# EAGLE design light_detector (EAGLE 7.7.0)
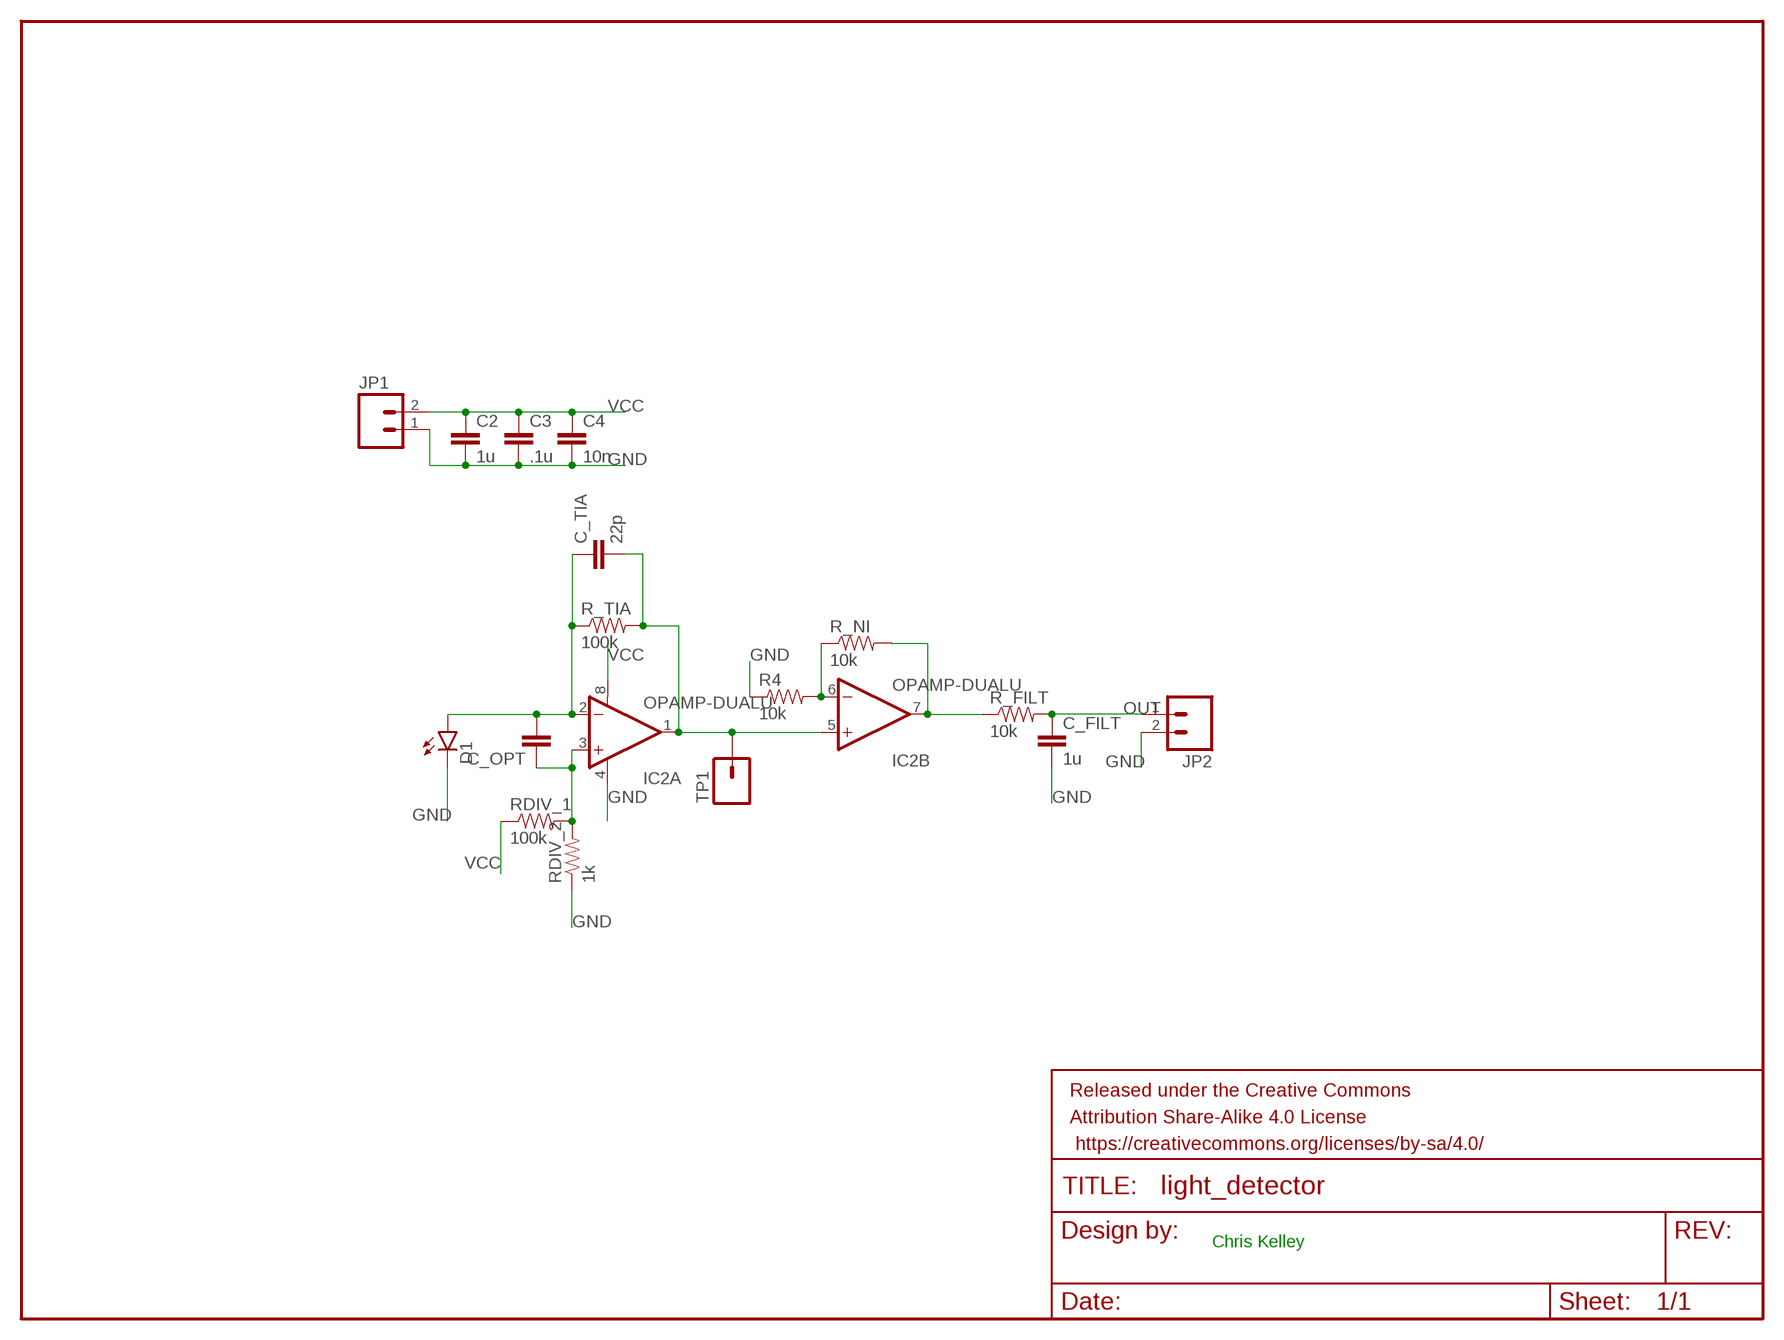
[diagram p0: schematic, sheet 1]

## Parts
C2  1u  CAP0805  [0805]
C3  .1u  CAP0805  [0805]
C4  10n  CAP0805  [0805]
C_FILT  1u  CAP0805  [0805]
C_OPT  CAP0805  [0805]
C_TIA  22p  CAP0805  [0805]
D1  LED5MM  [LED5MM]
FRAME1  FRAME-LETTER  [CREATIVE_COMMONS]
IC2  OPAMP-DUALU  [SO08]
JP1  M02PTH  [1X02]
JP2  M02PTH  [1X02]
R4  10k  RESISTOR0603-RES  [0603-RES]
R_FILT  10k  RESISTOR0603-RES  [0603-RES]
R_NI  10k  RESISTOR0603-RES  [0603-RES]
R_TIA  100k  RESISTOR0603-RES  [0603-RES]
RDIV_1  100k  RESISTOR0603-RES  [0603-RES]
RDIV_2  1k  RESISTOR0603-RES  [0603-RES]
TP1  M01PTH  [1X01]

## Nets
GND: C2.2 C3.2 C4.2 C_FILT.2 D1.K(C) IC2.4(A:V-) JP1.1 JP2.2 R4.1 RDIV_2.1
N$1: C_OPT.2 C_TIA.1 D1.A IC2.2(A:-IN) R_TIA.1
N$2: C_TIA.2 IC2.1(A:OUT) IC2.5(B:+IN) R_TIA.2 TP1.1
N$3: C_OPT.1 IC2.3(A:+IN) RDIV_1.2 RDIV_2.2
N$4: IC2.7(B:OUT) R_FILT.1 R_NI.2
N$5: IC2.6(B:-IN) R4.2 R_NI.1
OUT: C_FILT.1 JP2.1 R_FILT.2
VCC: C2.1 C3.1 C4.1 IC2.8(A:V+) JP1.2 RDIV_1.1

## Notes on the sheet
- Chris Kelley

## Library data of the parts
C2-C4 C_FILT C_OPT C_TIA = SparkFun-Passives:CAP: Capacitor Standard 0603 ceramic capacitor, and 0.1" leaded capacitor.
D1 = SparkFun-LED:LED: LEDs Standard schematic elements and footprints for 5mm, 3mm, 1206, and 0603 sized LEDs. 5mm - Spark Fun Electronics SKU : COM-00529 (and others)
FRAME1 = SparkFun-Aesthetics:FRAME-LETTER: Schematic Frame Standard 8.5x11 US Letter frame
IC2 = SparkFun-AnalogIC:OPAMP-DUAL: Generic op-amp footprint
JP1 JP2 = SparkFun-Connectors:M02: Standard 2-pin 0.1" header. Use with - straight break away headers ( PRT-00116) - right angle break away headers (PRT-00553) - swiss pins (PRT-00743) - machine pins (PRT-00117) - female headers (PRT-00115) Molex polarized connector foot print use with: PRT-08233 with associated crimp pins and housings. 2.54_SCREWTERM for use with PRT-10571. 3.5mm Screw Terminal footprints for PRT-08084 5mm Screw Terminal footprints for use with PRT-08432
R4 R_FILT R_NI R_TIA RDIV_1 RDIV_2 = SparkFun-Passives:RESISTOR: Resistor Basic schematic elements and footprints for 0603, 1206, and PTH resistors.
TP1 = SparkFun-Connectors:M01: Header 1 Standard 1-pin 0.1" header. Use with straight break away headers (SKU : PRT-00116), right angle break away headers (PRT-00553), swiss pins (PRT-00743), machine pins (PRT-00117), and female headers (PRT-00115).

## Board
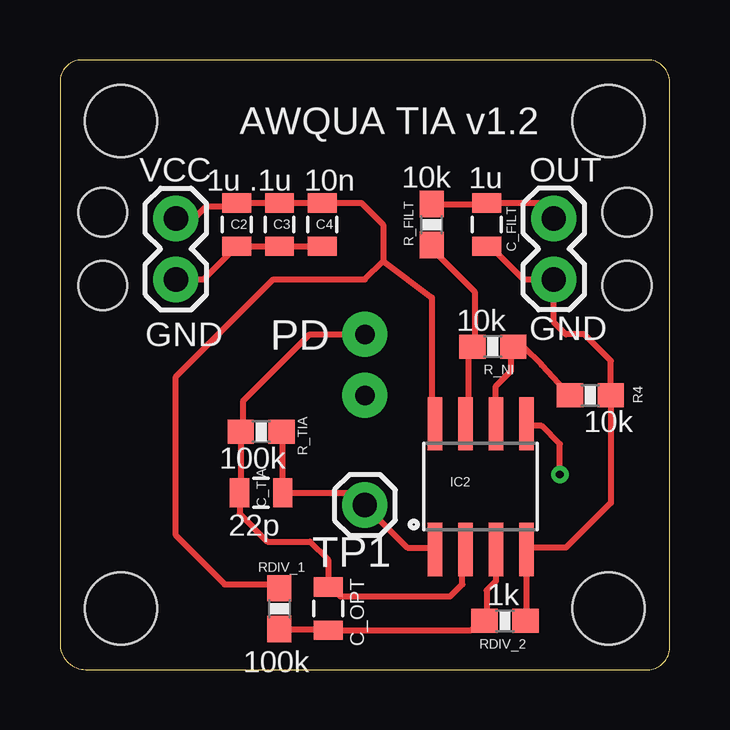
[diagram p1: board, top side]
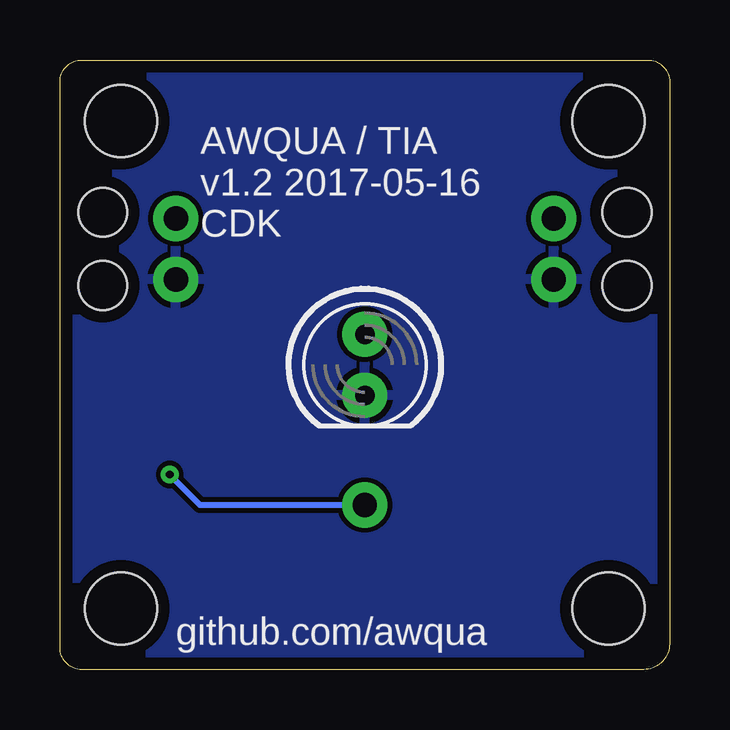
[diagram p2: board, bottom side, seen from below]

Size 25.4 x 25.4 mm. Coordinates in mm from the lower left corner, seen from the top.
Outline: 1.08,0 24.48,0 arc90 25.4,0.92 25.4,24.48 arc90 24.48,25.4 0.92,25.4 arc90 0,24.48 0,1.08 arc90 1.08,0
Copper layers (1*16): Top 0.035mm / dielectric 1.5mm / Bottom 0.035mm
Design rules "default *": minimum track width 8mil, minimum drill 12mil, track to track 8mil, track to pad 8mil, pad to pad 8mil, via to via 8mil, smd to smd 8mil, copper to edge 20mil, drill to drill 8mil, minimum pad ring 10mil, minimum via ring 8mil, stop-mask expansion 2mil, vias tented up to drill 13mil, thermal gap 10mil
Holes 3 mm at 22.86,2.54 22.86,22.86 2.54,22.86 2.54,2.54
Holes 2.03 mm at 1.78,19.05 1.78,16 23.62,19.05 23.62,16

### Footprints (pad centres in the part's own frame; a part is rotated, then mirrored left to right if it is on the bottom)
0805 = smd 0.8 x 1.2: 1 -0.9,0; 2 0.9,0
LED5MM = drill 0.813 pad 1.88: A -1.27,0; K 1.27,0
SO08 = smd 0.61 x 2.21: 1 -1.905,-2.616; 2 -0.635,-2.616; 3 0.635,-2.616; 4 1.905,-2.616; 5 1.905,2.616; 6 0.635,2.616; 7 -0.635,2.616; 8 -1.905,2.616
1X02 = drill 1.016 pad 1.88: 1 0,0; 2 2.54,0
0603-RES = smd 1.1 x 1: 1 -0.85,0; 2 0.85,0
1X01 = drill 1.016 pad 1.88: 1 0,0

### Placement (x,y rotation side)
C2  7.37,18.54 270 top
C3  9.14,18.54 270 top
C4  10.92,18.54 270 top
C_FILT  17.78,18.54 270 top
C_OPT  11.18,2.54 90 top
C_TIA  8.38,7.37 0 top
D1  12.7,12.7 270 bottom
FRAME1  16.51,-15.24 0 top  (outside the outline)
IC2  17.53,7.62 0 top
JP1  4.83,16.26 90 top
JP2  20.57,18.8 270 top
R4  22.1,11.43 180 top
R_FILT  15.49,18.54 90 top
R_NI  18.03,13.46 180 top
R_TIA  8.38,9.91 0 top
RDIV_1  9.14,2.54 270 top
RDIV_2  18.54,2.03 180 top
TP1  12.7,6.86 0 top

### Tracks (layer width: path | path; a pad name or v marks a point on that pad's centre or on a via)
GND
  Top 0.254: JP1.1 5.98,16.26 C2.2 C3.2 C4.2 | C_FILT.2 17.92,17.64 19.3,16.26 JP2.2 20.57,14.48 21.08,13.97 21.84,13.97 22.95,12.87 R4.1 22.95,6.95 21.08,5.08 19.56,5.08 19.56,5 IC2.4 19.43,2.07 RDIV_2.1
  pour Bottom: -5.84,29.21 32.26,30.48 32.26,-2.03 -5.84,-3.3
N$1
  Top 0.254: IC2.2 16.76,4.88 16.76,3.56 16.26,3.05 11.68,3.05 11.29,3.44 C_OPT.2 11.18,4.57 10.41,5.33 8.64,5.33 7.48,6.49 C_TIA.1 7.53,7.42 R_TIA.1 7.62,9.99 7.62,11.18 10.41,13.97 D1.A
N$2  (via drill 0.33)
  Top 0.254: v20.83,8.13 20.83,9.4 20.07,10.16 19.51,10.16 IC2.5 | R_TIA.2 9.28,9.86 C_TIA.2 12.19,7.37 TP1.1 14.48,5.08 15.54,5.08 IC2.1
  Bottom 0.254: TP1.1 19.56,6.86 v20.83,8.13
N$3
  Top 0.254: IC2.3 18.16,3.68 17.78,3.3 17.78,2.12 RDIV_2.2 | 17.44,1.78 RDIV_2.2 | RDIV_1.2 11.13,1.69 C_OPT.1 17.13,1.64 17.53,2.03 RDIV_2.2
N$4
  Top 0.254: R_FILT.1 15.49,17.53 17.27,15.75 17.27,13.55 R_NI.2 17.18,13.37 17.02,13.21 17.02,10.36 IC2.7
N$5
  Top 0.254: R4.2 20.07,12.7 19.3,13.46 R_NI.1 18.8,13.37 18.8,12.45 18.16,11.81 IC2.6
OUT
  Top 0.254: R_FILT.2 17.73,19.39 C_FILT.1 19.93,19.44 JP2.1
VCC
  Top 0.254: JP1.2 5.59,18.8 6.1,19.3 7.23,19.3 C2.1 C3.1 C4.1 12.56,19.44 13.46,18.54 13.46,17.02 | 13.46,17.02 15.49,15.49 15.49,10.36 IC2.8 | 13.46,17.02 12.7,16.26 8.89,16.26 4.83,12.19 4.83,5.59 6.86,3.56 8.98,3.56 RDIV_1.1

### Text on the board
tPlace: AWQUA TIA v1.2 | VCC | OUT | PD | GND | GND | Chris Kelley / AWQUA
bPlace: AWQUA / TIA / v1.2 2017-05-16 / CDK | github.com/awqua